# Altium schematic sheet top_tnb_mns_control.SchDoc
size A2; SheetNumber: 1; SheetTotal: 4
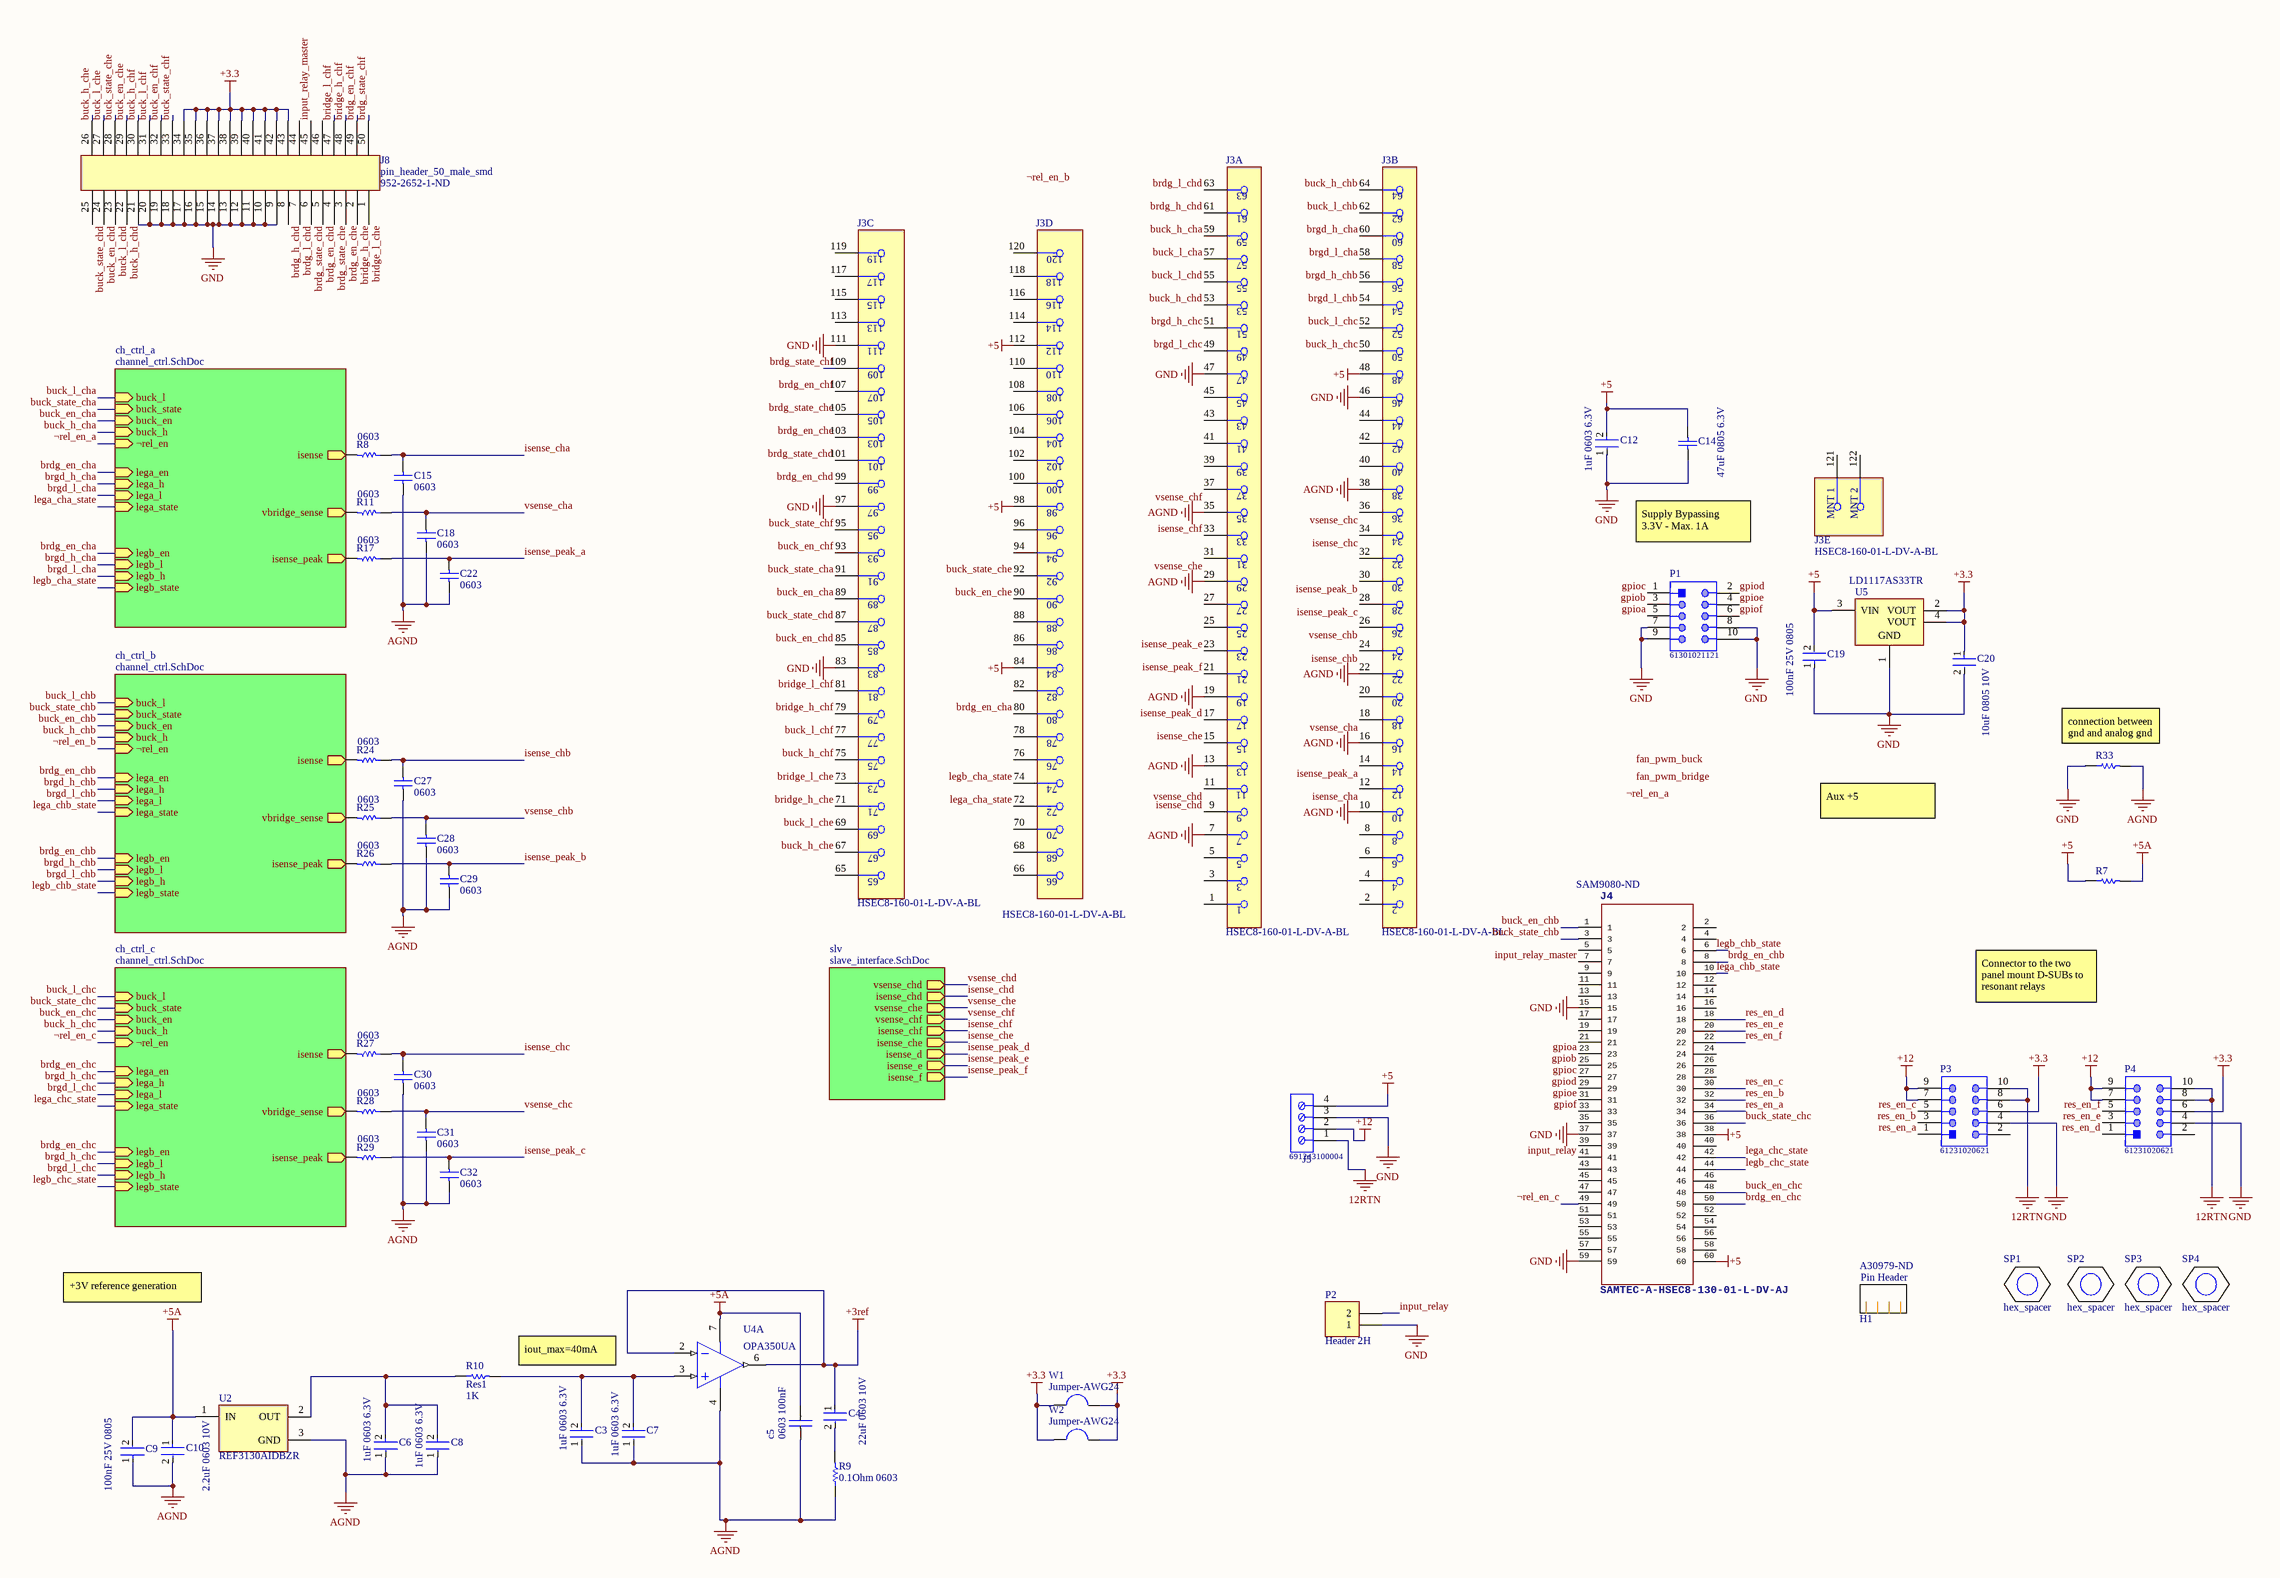
[diagram p0: top_tnb_mns_control.SchDoc]

## Parts
C3  1uF 0603 6.3V  [FP-GRM188-0_1-MFG]
C4  22uF 0603 10V  [FP-GRM188-0_2-IPC_C]
c5  0603 100nF  [CAP 0603_1608]
C6  1uF 0603 6.3V  [FP-GRM188-0_1-MFG]
C7  1uF 0603 6.3V  [FP-GRM188-0_1-MFG]
C8  1uF 0603 6.3V  [FP-GRM188-0_1-MFG]
C9  100nF 25V 0805  [FP-CC0805-0_85-MFG]
C10  2.2uF 0603 10V  [FP-GRM188-0_1-e0_2_0_5-MFG]
C12  1uF 0603 6.3V  [FP-GRM188-0_1-MFG]
C14  47uF 0805 6.3V  [CAPC2014X150X70LL20]
C15  0603  [CAP 0603_1608]
C18  0603  [CAP 0603_1608]
C19  100nF 25V 0805  [FP-CC0805-0_85-MFG]
C20  10uF 0805 10V  [FP-C0805C-DG-MFG]
C22  0603  [CAP 0603_1608]
C27  0603  [CAP 0603_1608]
C28  0603  [CAP 0603_1608]
C29  0603  [CAP 0603_1608]
C30  0603  [CAP 0603_1608]
C31  0603  [CAP 0603_1608]
C32  0603  [CAP 0603_1608]
H1  Supplier Part Number 1: A30979-ND  (hidden comment: Generic Pin  Header)
J3  HSEC8-160-01-L-DV-A-BL  [FP-HSEC8-160-01-L-DV-A-BL-MFG]  (parts A,B,C,D,E of 5)
J4  SAMTEC-A-HSEC8-130-01-L-DV-AJ  Supplier Part Number 1: SAM9080-ND  [SAMTEC-A-HSEC-120]
J5  691243100004  [691243100004]
J8  pin_header_50_male_smd  Supplier Part Number 1: 952-2652-1-ND  [pin_connector_50_m_1.27_smd]
P1  61301021121  [61301021121]
P2  Header 2H  [HEADER_1_2_f]
P3  61231020621  [61231020621]
P4  61231020621  [61231020621]
R7  0  [RES 0805_2012]  (value not drawn)
R8  0603  [RES 0603_1608]
R9  0.1Ohm 0603  [RESC1508X46X38NL25T25]
R10  Res1  value 1K  [RES 0603_1608]
R11  0603  [RES 0603_1608]
R17  0603  [RES 0603_1608]
R24  0603  [RES 0603_1608]
R25  0603  [RES 0603_1608]
R26  0603  [RES 0603_1608]
R27  0603  [RES 0603_1608]
R28  0603  [RES 0603_1608]
R29  0603  [RES 0603_1608]
R33  0  [RES 0805_2012]  (value not drawn)
SP1  hex_spacer  [HEX_SPACER_8MM_35MM]
SP2  hex_spacer  [HEX_SPACER_8MM_35MM]
SP3  hex_spacer  [HEX_SPACER_8MM_35MM]
SP4  hex_spacer  [HEX_SPACER_8MM_35MM]
U2  REF3130AIDBZR  [DBZ0003A_N]
U4  OPA350UA  [D0008A_M]  (part A of 2)
U5  LD1117AS33TR  [SOT-223_M]
W1  wire_jumper  [wire_jumper]  (value not drawn)
W2  wire_jumper  [wire_jumper]  (value not drawn)

## Sub-sheets
ch_ctrl_a = channel_ctrl.SchDoc: buck_l (in), buck_state (in), buck_en (in), buck_h (in), lega_en (in), lega_h (in), lega_l (in), lega_state (in), legb_en (in), legb_l (in), legb_h (in), legb_state (in), isense (out), vbridge_sense (out), isense_peak (out), ¬rel_en (in)
ch_ctrl_b = channel_ctrl.SchDoc: buck_l (in), buck_state (in), buck_en (in), buck_h (in), lega_en (in), lega_h (in), lega_l (in), lega_state (in), legb_en (in), legb_l (in), legb_h (in), legb_state (in), isense (out), vbridge_sense (out), ¬rel_en (in), isense_peak (out)
ch_ctrl_c = channel_ctrl.SchDoc: buck_l (in), buck_state (in), buck_en (in), buck_h (in), lega_en (in), lega_h (in), lega_l (in), lega_state (in), legb_en (in), legb_l (in), legb_h (in), legb_state (in), isense (out), vbridge_sense (out), ¬rel_en (in), isense_peak (out)
slv = slave_interface.SchDoc: vsense_chd (out), isense_chd (out), vsense_che (out), vsense_chf (out), isense_chf (out), isense_che (out), isense_d (out), isense_e (out), isense_f (out)

## Nets
12RTN: J5.1 P3.8 P3.10 P4.8 P4.10
+3.3: C20.1 J8.34 J8.35 J8.36 J8.37 J8.38 J8.39 J8.40 J8.41 J8.42 J8.43 P3.6 P4.6 U5.2(VOUT) U5.4(VOUT) W1.1 W1.2 W2.1 W2.2
+3ref: C4.1 U4.2(IN-) U4.6(OUT)
+5: C12.2 C14.2 C19.2 J3.48 J3.84 J3.98 J3.112 J4.38 J4.60 J5.4 R7.1 U5.3(VIN)
+5A: c5.1 C9.2 C10.1 R7.2 U2.1(IN) U4.7(V+)
+12: J5.2 P3.7 P3.9 P4.7 P4.9
AGND: C3.1 c5.2 C6.1 C7.1 C8.1 C9.1 C10.2 C15.1 C18.1 C22.1 C27.1 C28.1 C29.1 C30.1 C31.1 C32.1 J3.7 J3.10 J3.13 J3.16 J3.19 J3.22 J3.29 J3.35 J3.38 R9.1 R33.2 U2.3(GND) U4.4(V-)
GND: C12.1 C14.1 C19.1 C20.2 J3.46 J3.47 J3.83 J3.97 J3.111 J4.15 J4.37 J4.59 J5.3 J8.9 J8.10 J8.11 J8.12 J8.13 J8.14 J8.15 J8.16 J8.17 J8.18 J8.19 J8.20 J8.21 P1.7 P1.8 P1.9 P1.10 P2.1 P3.4 P4.4 R33.1 U5.1(GND)
brdg_en_cha: J3.80 ; sheet ch_ctrl_a/lega_en, sheet ch_ctrl_a/legb_en
brdg_en_chb: J4.8 ; sheet ch_ctrl_b/lega_en, sheet ch_ctrl_b/legb_en
brdg_en_chc: J4.50 ; sheet ch_ctrl_c/lega_en, sheet ch_ctrl_c/legb_en
brdg_en_chd: J3.99 J8.5
brdg_en_che: J3.103 J8.3
brdg_en_chf: J3.107 J8.49
brdg_h_chd: J3.61 J8.8
brdg_l_chd: J3.63 J8.7
brdg_state_chd: J3.101 J8.6
brdg_state_che: J3.105 J8.4
brdg_state_chf: J3.109 J8.50
brgd_h_cha: J3.60 ; sheet ch_ctrl_a/lega_h, sheet ch_ctrl_a/legb_l
brgd_h_chb: J3.56 ; sheet ch_ctrl_b/lega_h, sheet ch_ctrl_b/legb_l
brgd_h_chc: J3.51 ; sheet ch_ctrl_c/lega_h, sheet ch_ctrl_c/legb_l
brgd_l_cha: J3.58 ; sheet ch_ctrl_a/lega_l, sheet ch_ctrl_a/legb_h
brgd_l_chb: J3.54 ; sheet ch_ctrl_b/lega_l, sheet ch_ctrl_b/legb_h
brgd_l_chc: J3.49 ; sheet ch_ctrl_c/lega_l, sheet ch_ctrl_c/legb_h
bridge_h_che: J3.71 J8.2
bridge_h_chf: J3.79 J8.48
bridge_l_che: J3.73 J8.1
bridge_l_chf: J3.81 J8.47
buck_en_cha: J3.89 ; sheet ch_ctrl_a/buck_en
buck_en_chb: J4.1 ; sheet ch_ctrl_b/buck_en
buck_en_chc: J4.48 ; sheet ch_ctrl_c/buck_en
buck_en_chd: J3.85 J8.24
buck_en_che: J3.90 J8.29
buck_en_chf: J3.93 J8.32
buck_h_cha: J3.59 ; sheet ch_ctrl_a/buck_h
buck_h_chb: J3.64 ; sheet ch_ctrl_b/buck_h
buck_h_chc: J3.50 ; sheet ch_ctrl_c/buck_h
buck_h_chd: J3.53 J8.22
buck_h_che: J3.67 J8.26
buck_h_chf: J3.75 J8.30
buck_l_cha: J3.57 ; sheet ch_ctrl_a/buck_l
buck_l_chb: J3.62 ; sheet ch_ctrl_b/buck_l
buck_l_chc: J3.52 ; sheet ch_ctrl_c/buck_l
buck_l_chd: J3.55 J8.23
buck_l_che: J3.69 J8.27
buck_l_chf: J3.77 J8.31
buck_state_cha: J3.91 ; sheet ch_ctrl_a/buck_state
buck_state_chb: J4.3 ; sheet ch_ctrl_b/buck_state
buck_state_chc: J4.36 ; sheet ch_ctrl_c/buck_state
buck_state_chd: J3.87 J8.25
buck_state_che: J3.92 J8.28
buck_state_chf: J3.95 J8.33
gpioa: J4.23 P1.5
gpiob: J4.25 P1.3
gpioc: J4.27 P1.1
gpiod: J4.29 P1.2
gpioe: J4.31 P1.4
gpiof: J4.33 P1.6
input_relay: J4.41 P2.2
input_relay_master: J4.7 J8.45
isense_cha: C15.2 J3.12 R8.1
isense_chb: C27.2 J3.24 R24.1
isense_chc: C30.2 J3.34 R27.1
isense_chd: J3.9 ; sheet slv/isense_chd
isense_che: J3.15 ; sheet slv/isense_che
isense_chf: J3.33 ; sheet slv/isense_chf
isense_peak_a: C22.2 J3.14 R17.1
isense_peak_b: C29.2 J3.30 R26.1
isense_peak_c: C32.2 J3.28 R29.1
isense_peak_d: J3.17 ; sheet slv/isense_d
isense_peak_e: J3.23 ; sheet slv/isense_e
isense_peak_f: J3.21 ; sheet slv/isense_f
lega_cha_state: J3.72 ; sheet ch_ctrl_a/lega_state
lega_chb_state: J4.10 ; sheet ch_ctrl_b/lega_state
lega_chc_state: J4.42 ; sheet ch_ctrl_c/lega_state
legb_cha_state: J3.74 ; sheet ch_ctrl_a/legb_state
legb_chb_state: J4.6 ; sheet ch_ctrl_b/legb_state
legb_chc_state: J4.44 ; sheet ch_ctrl_c/legb_state
res_en_a: J4.34 P3.1
res_en_b: J4.32 P3.3
res_en_c: J4.30 P3.5
res_en_d: J4.18 P4.1
res_en_e: J4.20 P4.3
res_en_f: J4.22 P4.5
vsense_cha: C18.2 J3.18 R11.1
vsense_chb: C28.2 J3.26 R25.1
vsense_chc: C31.2 J3.36 R28.1
vsense_chd: J3.11 ; sheet slv/vsense_chd
vsense_che: J3.31 ; sheet slv/vsense_che
vsense_chf: J3.37 ; sheet slv/vsense_chf
¬rel_en_a: sheet ch_ctrl_a/¬rel_en
¬rel_en_b: sheet ch_ctrl_b/¬rel_en
¬rel_en_c: J4.49 ; sheet ch_ctrl_c/¬rel_en
NetC3_2: C3.2 C7.2 R10.2 U4.3(IN+)
NetC4_2: C4.2 R9.2
NetC6_2: C6.2 C8.2 R10.1 U2.2(OUT)
NetR8_2: R8.2 ; sheet ch_ctrl_a/isense
NetR11_2: R11.2 ; sheet ch_ctrl_a/vbridge_sense
NetR17_2: R17.2 ; sheet ch_ctrl_a/isense_peak
NetR24_2: R24.2 ; sheet ch_ctrl_b/isense
NetR25_2: R25.2 ; sheet ch_ctrl_b/vbridge_sense
NetR26_2: R26.2 ; sheet ch_ctrl_b/isense_peak
NetR27_2: R27.2 ; sheet ch_ctrl_c/isense
NetR28_2: R28.2 ; sheet ch_ctrl_c/vbridge_sense
NetR29_2: R29.2 ; sheet ch_ctrl_c/isense_peak

Not connected (* = marked no-connect by the designer): J3 1 2 3 4 5 6 8 20 25 27 32 39 40 41 42 43 44 45 65 66 68 70 76 78 82 86 88 94 96 100 102 104 106 108 110 113 114 115 116 117 118 119 120 121(MNT_1) 122(MNT_2); J4 2 4 5 9 11 12 13 14 16 17 19 21 24 26 28 35 39 40 43 45 46 47 51 52 53 54 55 56 57 58; J8 44 46; P3 2; P4 2

## Notes on the sheet
- Supply Bypassing
  3.3V - Max. 1A
- (near R33) connection between gnd and analog gnd
- Aux +5
- Connector to the two panel mount D-SUBs to resonant relays
- +3V reference generation
- (near R10) iout_max=40mA
- Labels drawn without touching a wire or pin: fan_pwm_bridge, fan_pwm_buck, ¬rel_en_a, ¬rel_en_b
- Drawing title:
- Drawing number:
- Rev:
- Format:
- Laboratory:
- Project:
- File:
- Date:
- A2
- Drawn by:
- Page
- of
- (in symbol generic_pin_header) Pin Header
- (in symbol wire_jumper) Jumper-AWG24

## Library data of the parts
C3 C6-C8 C12 = CMP-2006-02790-2: CAP CER 1UF 6.3V X5R 0603 / GRM188R60J105KA01D; Insulation Resistance: 500MR; Tolerance: 10%; Dielectric Material: Ceramic; Thickness: 0.035inch; Depth: 0.8mm; Min Operating Temperature: -55°C; Mount: Surface Mount; Voltage Rating (DC): 6.3V; Case/Package: 0603; Capacitance: 1uF; Voltage Rating: 6.3V; Voltage: 6.3V; Max Operating Temperature: 85°C; Case Code (Imperial): 0603; Dielectric: X5R; Packaging: Tape and Reel; Height: 0.8mm; Case Code (Metric): 1608; Radiation Hardening: No; REACH SVHC: No SVHC; Width: 0.031inch; Package Quantity: 1; Lead Free: Lead Free; Length: 1.6mm; Termination: SMD/SMT
C4 = CMP-2000-06337-3: Chip Multilayer Ceramic Capacitors for General Purpose, 0603, 22uF, X5R, 15%, 20%, 10V / GRM188R61A226ME15D; Tolerance: 20%; Weight: 0.000222oz; Material: Ceramic; Depth: 0.8mm; Length: 1.6mm; Termination: SMD/SMT; Capacitance: 22uF; Packaging: Tape and Reel; Width: 0.8mm; Voltage Rating: 10V; Case Code (Imperial): 0603; Mount: Surface Mount; Voltage Rating (DC): 10V; Case/Package: 0603; Thickness: 0.039inch; REACH SVHC: No SVHC; Dielectric: X5R; Height: 0.8mm; Package Quantity: 4000; Case Code (Metric): 1608; Min Operating Temperature: -55°C; Lead Free: Lead Free; Max Operating Temperature: 85°C
c5 = cap_smd: Supplier 1: Digi-Key; Supplier Part Number 1: 445-5666-1-ND
C9 C19 = CMP-1036-04410-2: CAP CER 0.1UF 25V X7R 0805; Manufacturer Part Number: CC0805KRX7R8BB104; Manufacturer: Yageo; Tolerance: 0.1; Material: Ceramic; ComponentLink2URL: http://www.yageo.com/documents/recent/UPY-GPHC_Y5V_6.3V-to-50V_8.pdf; Category: Cap; Mouser Description: Multilayer Ceramic Capacitors MLCC - SMD/SMT 100nF 25V X7R 10%; Device Class L1: Passive Components; Footprint Url: http://www.yageo.com/exep/pages/download/literatures/UPY-C_GEN_24.pdf; Height: 0.95mm; Digikey Description: CAP CER 0.1UF 25V X7R 0805; Lead Free: Yes; Temperature Range High: +85°C; Temperature: -30°C to +85°C; Ipc Land Pattern Name: CAPC200125X85; Value: 100 nF; Capacitance: 100 nF; Automotive: No; Octopart: https://octopart.com/cc0805krx7r8bb104-yageo-39467766; Device Class L2: Capacitors; Temperature Characteristic: X7R; Voltage Rating: 25 V; ComponentLink2Description: Datasheet; Temperature Range Low: -30°C; Device Class L3: Ceramic Capacitors; RoHS: TRUE; Package: CC0805-0.85
C10 = CMP-2006-02836-2: Chip Multilayer Ceramic Capacitors for General Purpose, 0603, 2.2uF, X7R, 15%, 10%, 10V / GRM188R71A225KE15D; Case Code (Metric): 1608; Height: 0.8mm; Packaging: Cut Tape; Voltage: 10V; Lead Free: Lead Free; Min Operating Temperature: -55°C; Voltage Rating (DC): 10V; Max Operating Temperature: 125°C; Voltage Rating: 10V; Dielectric: X7R; Depth: 0.8mm; Case Code (Imperial): 0603; Termination: SMD/SMT; Case/Package: 0603; Number of Pins: 2; REACH SVHC: No SVHC; Mount: Surface Mount; Width: 0.031inch; Material: Ceramic; Capacitance: 2.2uF; Package Quantity: 1; Weight: 7.1E-05oz; Length: 1.6mm; Thickness: 0.035inch; Tolerance: 10%
C14 = CMP-2007-00044-1: TACR476M006XTA; Manufacturer: AVX Interconnect / Elco; Part Number: TACR476M006XTA
C15 C18 C22 C27-C32 = Cap: Capacitor; Published: 8-Jun-2000; LatestRevisionDate: 17-Jul-2002; LatestRevisionNote: Re-released for DXP Platform.; PackageReference: RAD-0.3; Publisher: Altium Limited; PackageDescription: Radial Cap, Thru-Hole; 2 Leads; 0.3 in Pin Spacing
C20 = CMP-2007-03243-2: CAP CER 10UF 10V X5R 0805 / C0805C106K8PACTU; Manufacturer: Kemet; 3DS Part Number: 220-00001; Tolerance: 10%; Temperature Coefficient: 15%; Material: Ceramic; Device Class L2: Capacitors; Device Class L1: Passive Components; ComponentLink2URL: https://content.kemet.com/datasheets/KEM_C1006_X5R_SMD.pdf; Height: 1.4mm; Lead Free: Yes; Manufacturer Part Number: C0805C106K8PACTU; Digikey Description: CAP CER 10UF 10V X5R 0805; Octopart: https://octopart.com/c0805c106k8pactu-kemet-98697; Capacitance: 10uF; Value: 10uF; Temperature Range Low: -55°C; Temperature: -55°C to +85°C; Automotive: No; Mouser Description: CAP CER 10UF 10V X5R 0805; Ipc Land Pattern Name: CAPC200125X125; Temperature Range High: +85°C; Voltage: 10V; RoHS: TRUE; Device Class L3: Ceramic Capacitors; ComponentLink2Description: Datasheet; Voltage Rating: 10V; Package: C0805C-DG; Temperature Characteristic: X5R; Category: Cap
H1 = generic_pin_header: Assign Supplier Link Manually; Supplier 1: Digi-Key
J3 = CMP-02762-000006-1: CONN EDGE DUAL FMALE 120P 0.031; Pitch: 0.8mm; Gender: Female; Number of Contacts: 120; Contact Type: Cantilever; Packaging: Tray; Termination: Solder; Radiation Hardening: No; Min Operating Temperature: -55°C; Insulation Material: Polymer; Series: Edge Rate™ HSEC8; Contact Plating: Gold; Number of Positions: 120; Contact Material: Copper; RoHS Compliant: Yes; Color: Black; Number of Rows: 2; Max Operating Temperature: 125°C; Mount: Surface Mount
J5 = CMP-1502-02476-1: Serie 2431- 3.50 mm Vertical Entry with Rising Cage Clamp WR-TBL, 4 pin; Manufacturer: Wurth Elektronik; Pin Number: 4; Pitch: 3.50mm; Operating Temperature: -30to120degC; Mounting Technology: THT; Package Reference: 691243100004; Datasheet URL: http://katalog.we-online.de/em/datasheet/6912431000xx.pdf; Part Number: 691243100004; Publisher: WurthElektronik; Manufacturer URL: http://www.we-online.de; Packaging: Box
J8 = pin_header_50_male_smd: Mating Product : 952-2565-ND; Supplier 1: Digi-Key
P1 = CMP-1502-01084-1: THT Vertical Pin Header WR-PHD, Pitch 2.54 mm, Dual Row, 10 pins; Manufacturer: Wurth Elektronik; Working Voltage: 250VAC; Pitch: 2.54mm; Contact Resistance: 20mOhm; Gender: Male; Rated Current: 3A; Withstanding Voltage: 500VAC; Pin Number: 10; Operating Temperature: -40to105degC; Mounting Technology: THT; Publisher: WurthElektronik; Manufacturer URL: http://www.we-online.de; Part Number: 61301021121; Row Number: Dual; Packaging: Bag; Orientation: Vertical; Package Reference: 61301021121; Datasheet URL: https://katalog.we-online.de/em/datasheet/6130xx21121.pdf
P2 = Header 2H: Header, 2-Pin, Right Angle; LatestRevisionDate: 17-Jul-2002; LatestRevisionNote: Re-released for DXP Platform.; Publisher: Altium Limited
P3 P4 = CMP-1502-00060-1: Male Box Header WR-BHD, SMT, Vertical, pitch 2.54 mm, 10 pins; Manufacturer: Wurth Elektronik; Withstanding Voltage: 500VAC; Pin Number: 10; Contact Resistance: 20mOhm; Pitch: 2.54mm; Working Voltage: 250VAC; Package Reference: 61231020621; Publisher: WurthElektronik; Manufacturer URL: http://www.we-online.de; Datasheet URL: https://katalog.we-online.de/em/datasheet/6123xx20621.pdf; Orientation: Vertical; Mounting Technology: SMT; Packaging: TapeandReel; Published Date: August2018; Operating Temperature: -40to125degC; Gender: Male; Part Number: 61231020621
R7 R8 R10 R11 R17 R24-R29 R33 = Res1: Resistor; Published: 8-Jun-2000; LatestRevisionDate: 17-Jul-2002; LatestRevisionNote: Re-released for DXP Platform.; PackageReference: AXIAL-0.3; Publisher: Altium Limited; PackageDescription: Axial Device, Thru-Hole; 2 Leads; 0.3 in Pin Spacing
R9 = CMP-2000-03814-1: WSL0603R1000FEA; Manufacturer: Vishay Dale; Part Number: WSL0603R1000FEA
U2 = CMP-0367-00139-2: 20 ppm / degC Max, 100 uA Series Voltage Reference, -40 to 125 degC, 3-pin SOT-23 (DBZ), Green (RoHS & no Sb/Br); Manufacturer: Texas Instruments; Temp Coeff(Max)(ppm/ degree C): 20; Temp Coeff(Typ)(ppm/ degree C): 10; VO(V): 3; Rating: Catalog; Iq(Max)(uA): 100; Initial Accuracy @ 25/deg C(%): 0.2; VI(Min)(V): 3.05; VI(Max)(V): 5.5; ComponentLink1Description: Manufacturer URL; PackageDescription: 3-Pin Plastic Small Outline, Body 2.92 x 1.3 mm, Pitch 0.95 mm; ComponentLink3URL: http://www.ti.com/litv/pdf/mpds108a; ComponentLink2URL: http://www.ti.com/lit/ds/symlink/ref3130.pdf; Mounting Technology: Surface Mount; ComponentLink2Description: Datasheet; SubFamily: Series Voltage Reference; Eco-Plan: Green (RoHS & no Sb/Br); ComponentLink3Description: Package Specification; PackageReference: DBZ0003A; DatasheetVersion: SBVS046C; PartNumber: REF3130AIDBZR; ComponentLink1URL: http://www.ti.com/; PackageVersion: 4203227/B; Code_JEDEC: TO-236
U4 = CMP-0271-00145-3: High-Speed, Single-Supply, Rail-to-Rail Operational Amplifier MicroAmplifier(TM) Series, 2.7 to 5.5 V, -40 to 85 degC, 8-pin SOIC (D8), Green (RoHS & no Sb/Br); Manufacturer: Texas Instruments; IIB(Max)(pA): 10; Iq per channel(Max)(mA): 8.5; Number of Channels: 1; CMRR(Min)(dB): 66; Slew Rate(Typ)(V/us): 22; Total Supply Voltage(Max)(+5V is 5, +/-5V is 10): 5.5; Sub Family: Low Input Bias Current Amp (<=10pA), Low Offset Voltage Amplifier (<=500uV), Low Supply Voltage Amplifier (<=2.7V), Precision Amplifier; Offset Drift(Typ)(uV/C): 4; Total Supply Voltage(Min)(+5V is 5, +/-5V is 10): 2.7; Vn at 1kHz(Typ)(nV/rtHz): 18; PackageReference: D0008A; PackageDescription: 8-Pin Plastic Small Outline, Body 4.9 x 3.9 mm, Pitch 1.27 mm; Code_JEDEC: MS-012; Eco-Plan: Green (RoHS & no Sb/Br); DatasheetVersion: SBOS099C; Vio (25C)(Max)(mV): 1; ComponentLink1URL: http://www.ti.com/; ComponentLink3URL: http://www.ti.com/litv/pdf/msoi002j; PackageVersion: 4040047-3/M, 06/2011; ComponentLink3Description: Package Specification; ComponentLink2URL: http://www.ti.com/general/docs/lit/getliterature.tsp?genericPartNumber=OPA350&fileType=pdf; PartNumber: OPA350UA; ComponentLink2Description: Datasheet; ComponentLink1Description: Manufacturer URL; Mounting Technology: Surface Mount
U5 = CMP-0244-00316-1: 1A, Low Drop Positive Voltage Regulator, 3.3V, 4-Pin SOT-223, Tape and Reel; ComponentLink1Description: Manufacturer URL; DatasheetVersion: 2/12/2011; PackageVersion: 2010; ComponentLink1URL: http://www.st.com; ComponentLink2Description: Datasheet; ComponentLink2URL: http://www.st.com/internet/com/TECHNICAL_RESOURCES/TECHNICAL_LITERATURE/DATASHEET/CD00002116.pdf; PackageDescription: 4-Pin SOT-223 Package, 6.5 x 3.5 mm Body, 2.3 mm Pitch, 7 mm Lead Span; PackageReference: SOT-223
J4 = SAMTEC-A-HSEC8-130-01-L-DV-AJ: Supplier 1: Digi-Key